# EAGLE design shield (EAGLE 6.6.0)
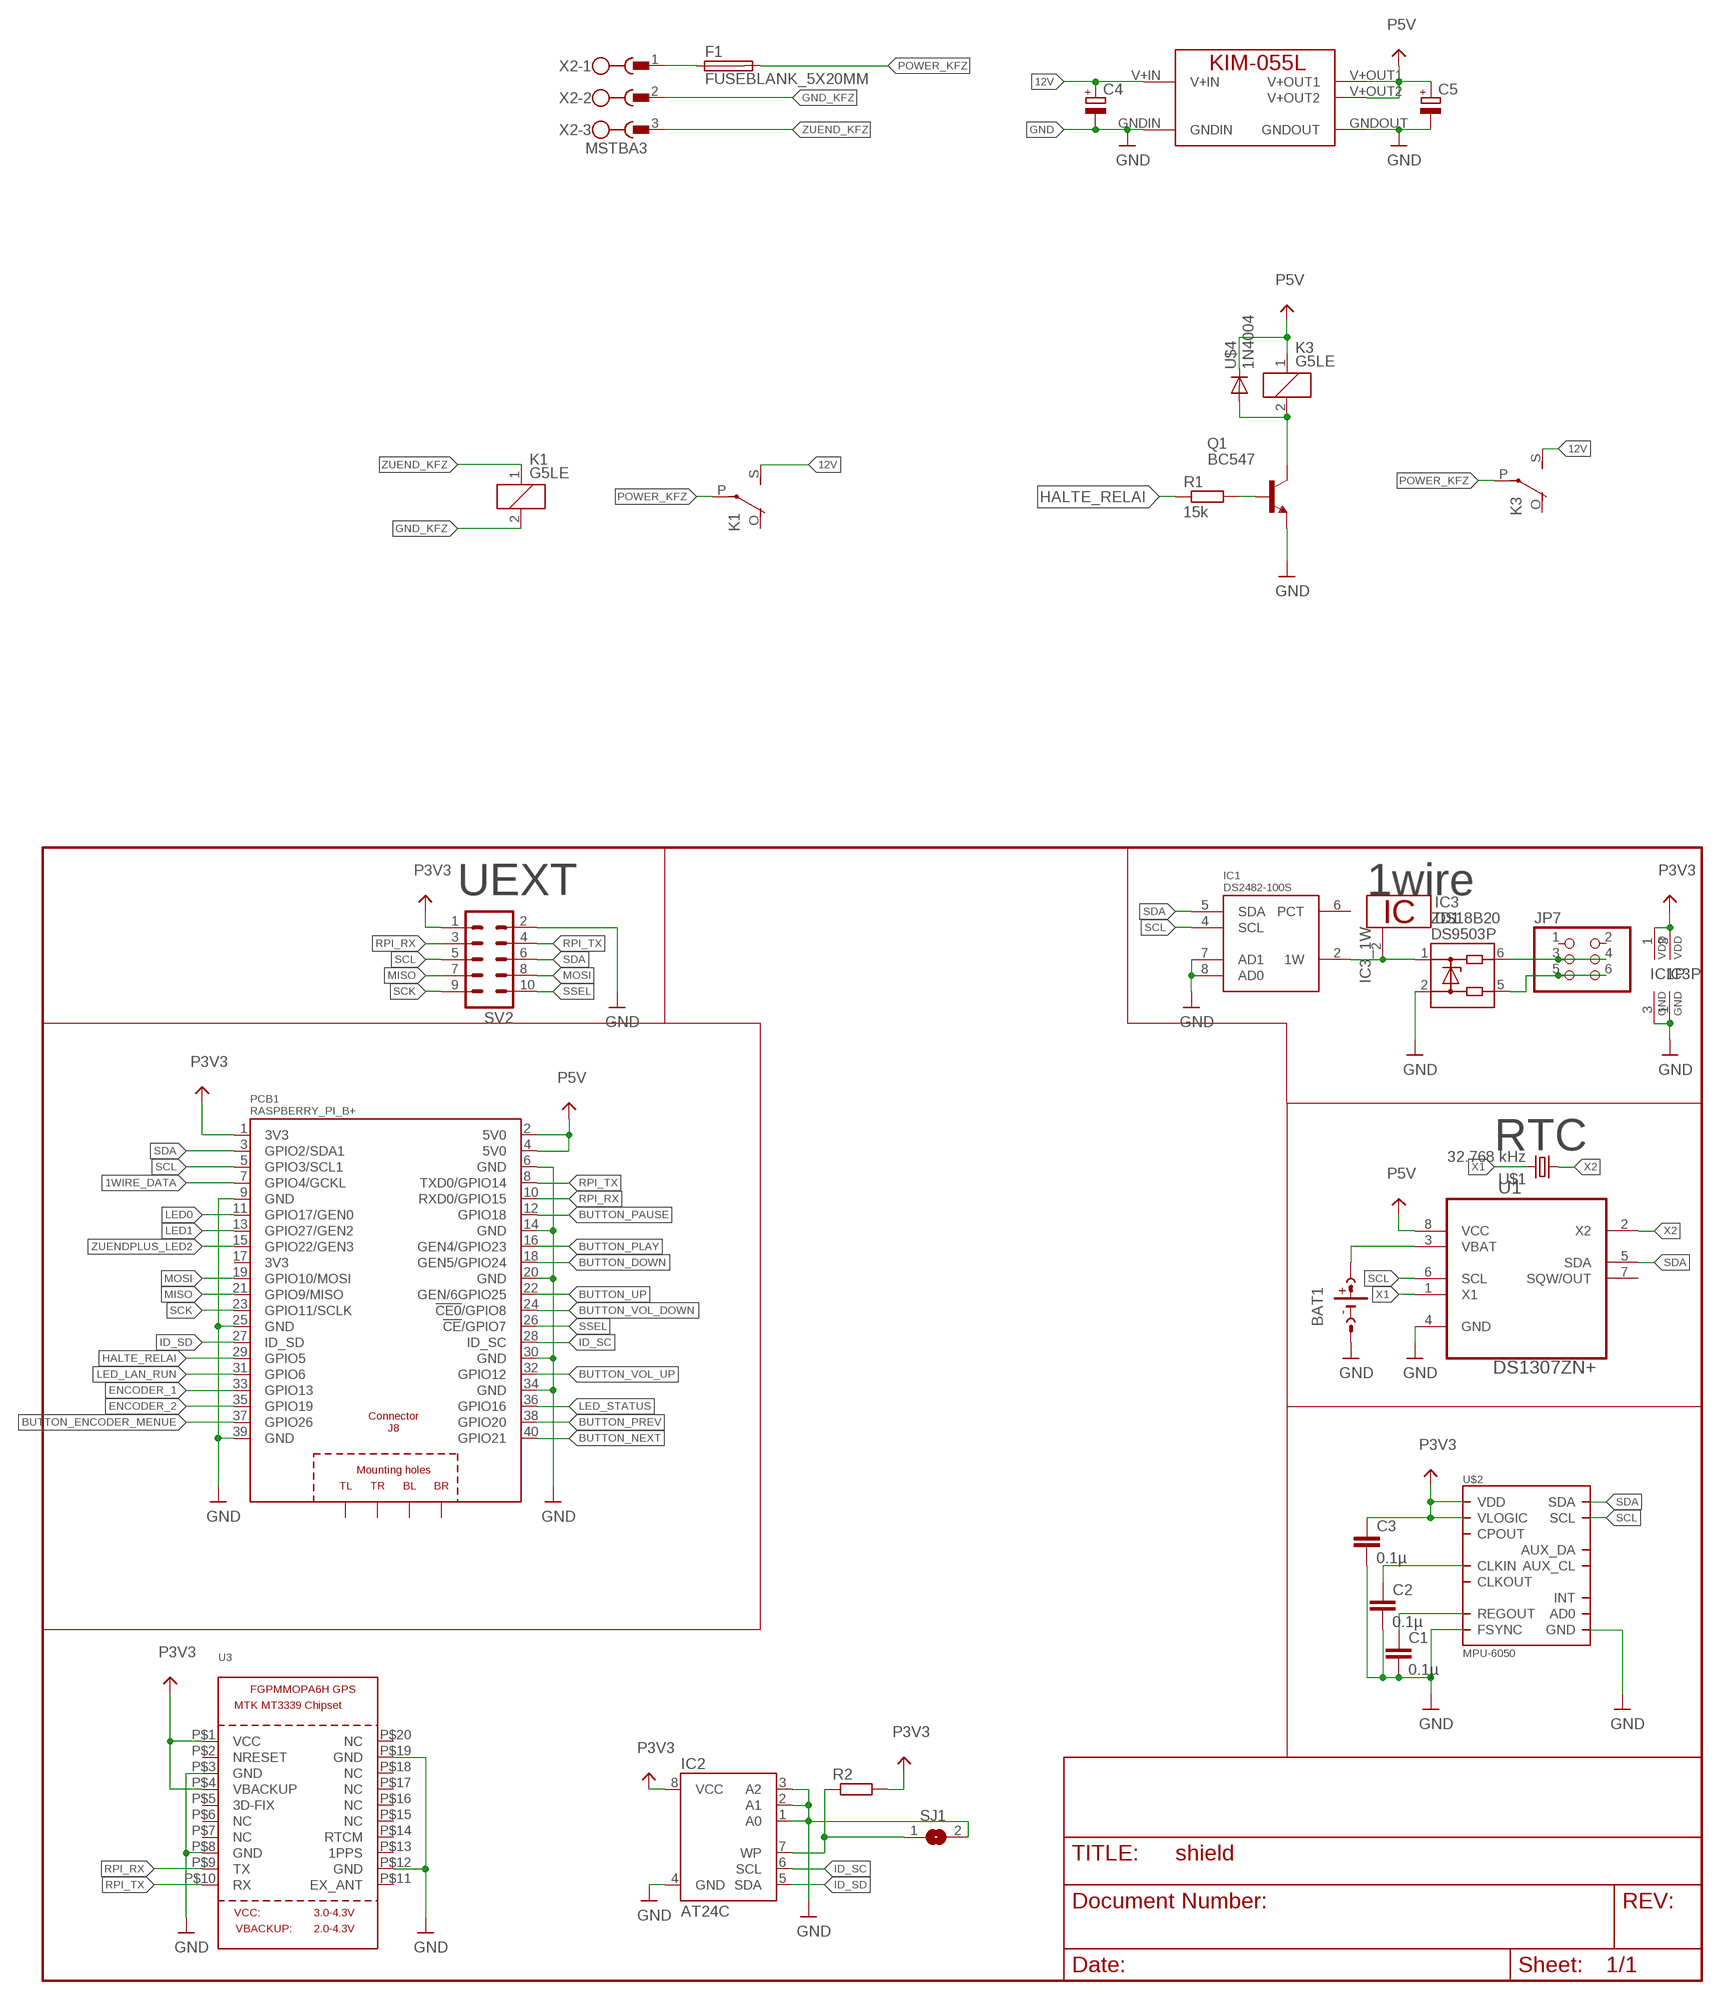
[diagram p0: schematic, sheet 1]

## Parts
BAT1  CR2032  [CR2032-SOCKET]
C1  0.1µ  C-EUC0805  [C0805]
C2  0.1µ  C-EUC0805  [C0805]
C3  0.1µ  C-EUC0805  [C0805]
C4  CPOL-EUE5-13  [E5-13]
C5  CPOL-EUE5-13  [E5-13]
F1  FUSEBLANK_5X20MM  [FUSE_HOLDER_5X20MM]
IC1  DS2482-100S  [SO08]
IC2  AT24C  [SO08]
IC3  DS18B20  [TO92-]
JP7  PINHD-2X3/90  [2X03/90]
K1  G5LE  [G5LE]
K3  G5LE  [G5LE]
MOD1  KIM-055L  [KIM-055L]
PCB1  RASPBERRY_PI_B+  [RASPBERRY_PI_B+]
Q1  BC547  [TO92]
R1  15k  R-EU_0207/7  [0207/7]
R2  R-EU_R0805  [R0805]
SJ1  SJM  [SJM]
SV2  ML10  [ML10]
U1  DS1307ZN+  [SOIC127P600X175-8N]
U3  GPS_FGPMMOPA6H  [FGPMMOPA6H]
U$1  32.768 kHz  CC5V-12,5  [CC5]
U$2  MPU-6050  [QFN.24.4X4]
U$4  1N4004  [DO41-10]
X2  MSTBA3  [MSTBA3]
ZD1  DS9503P  [TSOC6]

## Nets
1WIRE_DATA: IC1.2(1W) IC3.2 PCB1.7(GPIO4/GCKL) ZD1.1
12V: C4.+ K1.S(2:S) K3.S(2:S) MOD1.V+IN
BUTTON_DOWN: PCB1.18(GEN5/GPIO24)
BUTTON_ENCODER_MENUE: PCB1.37(GPIO26)
BUTTON_NEXT: PCB1.40(GPIO21)
BUTTON_PAUSE: PCB1.12(GPIO18)
BUTTON_PLAY: PCB1.16(GEN4/GPIO23)
BUTTON_PREV: PCB1.38(GPIO20)
BUTTON_UP: PCB1.22(GEN/6GPIO25)
BUTTON_VOL_DOWN: PCB1.24(!CE0!/GPIO8)
BUTTON_VOL_UP: PCB1.32(GPIO12)
ENCODER_1: PCB1.33(GPIO13)
ENCODER_2: PCB1.35(GPIO19)
GND: BAT1.M(NEG) C1.2 C2.2 C3.2 C4.- C5.- IC1.3(GND) IC1.7(AD1) IC1.8(AD0) IC2.1(A0) IC2.2(A1) IC2.3(A2) IC2.4(GND) IC3.1 MOD1.GNDIN MOD1.GNDOUT PCB1.6(GND) PCB1.14(GND) PCB1.20(GND) PCB1.30(GND) PCB1.34(GND) Q1.1(E) SJ1.2 SV2.2 U1.4(GND) U3.P$3(GND) U3.P$8(GND) U3.P$12(GND) U3.P$19(GND) U$2.11(FSYNC) U$2.18(GND) ZD1.2
GND@1: PCB1.9(GND) PCB1.25(GND) PCB1.39(GND) ; supply symbol labelled GND
GND_KFZ: K1.2 X2.2
HALTE_RELAI: PCB1.29(GPIO5) R1.1
ID_SC: IC2.6(SCL) PCB1.28(ID_SC)
ID_SD: IC2.5(SDA) PCB1.27(ID_SD)
LED0: PCB1.11(GPIO17/GEN0)
LED1: PCB1.13(GPIO27/GEN2)
LED_LAN_RUN: PCB1.31(GPIO6)
LED_STATUS: PCB1.36(GPIO16)
MISO: PCB1.21(GPIO9/MISO) SV2.7
MOSI: PCB1.19(GPIO10/MOSI) SV2.8
N$1: BAT1.P(POS2) U1.3(VBAT)
N$2: K3.2 Q1.3(C) U$4.A
N$3: C1.1 U$2.10(REGOUT)
N$4: C2.1 U$2.1(CLKIN)
N$5: IC2.7(WP) R2.1 SJ1.1
N$6: Q1.2(B) R1.2
N$7: F1.1 X2.1
N$9: JP7.3 JP7.4 ZD1.6
N$10: JP7.5 JP7.6 ZD1.5
P3V3: C3.1 IC1.1(VDD) IC2.8(VCC) IC3.3 PCB1.1(3V3) R2.2 SV2.1 U3.P$1(VCC) U3.P$4(VBACKUP) U$2.8(VLOGIC) U$2.13(VDD)
P5V: C5.+ K3.1 MOD1.V+OUT1 MOD1.V+OUT2 PCB1.2(5V0) PCB1.4(5V0) U1.8(VCC) U$4.C
POWER_KFZ: F1.2 K1.P(2:P) K3.P(2:P)
RPI_RX: PCB1.10(RXD0/GPIO15) SV2.3 U3.P$9(TX)
RPI_TX: PCB1.8(TXD0/GPIO14) SV2.4 U3.P$10(RX)
SCK: PCB1.23(GPIO11/SCLK) SV2.9
SCL: IC1.4(SCL) PCB1.5(GPIO3/SCL1) SV2.5 U1.6(SCL) U$2.23(SCL)
SDA: IC1.5(SDA) PCB1.3(GPIO2/SDA1) SV2.6 U1.5(SDA) U$2.24(SDA)
SSEL: PCB1.26(!CE!/GPIO7) SV2.10
X1: U1.1(X1) U$1.P$2
X2: U1.2(X2) U$1.P$1
ZUEND_KFZ: K1.1 X2.3
ZUENDPLUS_LED2: PCB1.15(GPIO22/GEN3)
Unconnected: IC1.6(PCT) JP7.1 JP7.2 K1.O(2:O) K3.O(2:O) PCB1.17(3V3) PCB1.PE_BL(BL) PCB1.PE_BR(BR) PCB1.PE_TL(TL) PCB1.PE_TR(TR) U1.7(SQW/OUT) U3.P$2(NRESET) U3.P$5(3D-FIX) U3.P$6(NC) U3.P$7(NC) U3.P$11(EX_ANT) U3.P$13(1PPS) U3.P$14(RTCM) U3.P$15(NC) U3.P$16(NC) U3.P$17(NC) U3.P$18(NC) U3.P$20(NC) U$2.6(AUX_DA) U$2.7(AUX_CL) U$2.9(AD0) U$2.12(INT) U$2.20(CPOUT) U$2.22(CLKOUT)

## Notes on the sheet
- UEXT | 1wire
- RTC

## Library data of the parts
BAT1 = con_bat_2032__s_:CR2032
C1-C3 = schlager_passiv:C-EU: CAPACITOR, European symbol
C4 C5 = schlager_passiv:CPOL-EU: POLARIZED CAPACITOR, European symbol
F1 = fuse:FUSE: Fuse; OC_FARNELL: unknown; OC_NEWARK: unknown
IC1 = 1wire:DS2482-100: I2C to 1-Wire Host Adapter/Line Driver This device is a onewire host and I2C interface in one chip. It provides the complete DC/AC requirements for onewire communication, including overdrive speed mode, but, unlike the DS2480B chip, no 12V EPROM programming. Notes: For overdrive speed and 5V EEPROM programming, an external active pullup circuit must be connected to the 1W, VDD and PCT pin. See the datasheet for details. The lower two I2C adress bits of the chip can be selected by external pins, so up to 4 chips may be connected to the same I2C bus. Author: Orginal device and description from Giovanni Varasano <giovanni.varasano@fastwebnet.it> Improved by Jan Kandziora <jjj@gmx.de>
IC2 = schlager_ics:AT24C*: 2-wire serial EEPROM
IC3 = 1wire:DS18B20: Programmable Resolution Digital Thermometer This chip provides a onewire thermosensor with approx. 0.5°C accuracy. A programmable over/undertemperure alarm is available. The precision can be set from 9..12 bits. Notes: Vdd must be applied for accurate measurements at low temperatures, as the parasite power circuit otherwise heats the sensor. If parasite power is used, Vdd has to be connected to GND. The DS1822 is a low-cost thermometer chip, the DS18S20 is similar to the DS18B20, but with 9 Bit precision only. Author: Jan Kandziora <jjj@gmx.de>
JP7 = pinhead:PINHD-2X3: PIN HEADER
K1 K3 = relay:G5LE: RELAY 1 x switch, 10 A/120 V AC, 8 A/30 V DC, Omron; OC_FARNELL: unknown; OC_NEWARK: unknown
MOD1 = kim055l:KIM-055L: 5V 5amp DC DC module. IMPORANT: Add low ESR input & output capacitors. V+OUT1 & V+OUT2 internally connected.
PCB1 = RASPBERRY_PI_Bplus:RASPBERRY_PI_B+: Raspberry Pi B+ Based on issue: Thursday, July 10, 2014 - Rev 1.2 LBR by Tim R. 07-2014
Q1 = transistor-npn:BC547*: NPN Transistor
R1 R2 = schlager_passiv:R-EU_: RESISTOR, European symbol
SJ1 = jumper:SJ: SMD solder JUMPER
SV2 = X_Pfostenstecker:ML10: HARTING; OC_FARNELL: unknown; OC_NEWARK: unknown
U1 = schlager_ics:DS1307ZN+: 64 x 8, Serial, I2C Real-Time Clock; MPN: DS1307ZN+; OC_FARNELL: 9725253; OC_NEWARK: 96K8872; PACKAGE: SOIC-8; SUPPLIER: Maxim
U3 = adafruit:GPS_FGPMMOPA6H: GPS Module - MTK MT3339 Chipset, -165dBm sensitivity, 22 channels, 10Hz, auto-select external antenna options
U$1 = schlager_Quarze:CC5V; MPN: CC5V-T1A 32,768KHZ 12,5PF; OC_FARNELL: 1539374RL; OC_REICHELT: 32,768 CC5V-12,5
U$2 = invensense:MPU-6050
U$4 = diode:1N4004: DIODE general purpose rectifier, 1 A
X2 = X_Phoenix:MSTBA3: PHOENIX
ZD1 = 1wire:DS9503: ESD Protection Diode with Resistors This ESD protection diode is designed especially for onewire host interfaces. Unlike the DS9502, it has two additional 5Ohm resitors in the 1W and GND line. Pin 5 and 6 have to be connected to the host side, pin 1 und 2 to the network side. The 1W line is through pin 1 and 6, the GND line is through pin 2 and 5. Author: Jan Kandziora <jjj@gmx.de>

## Board
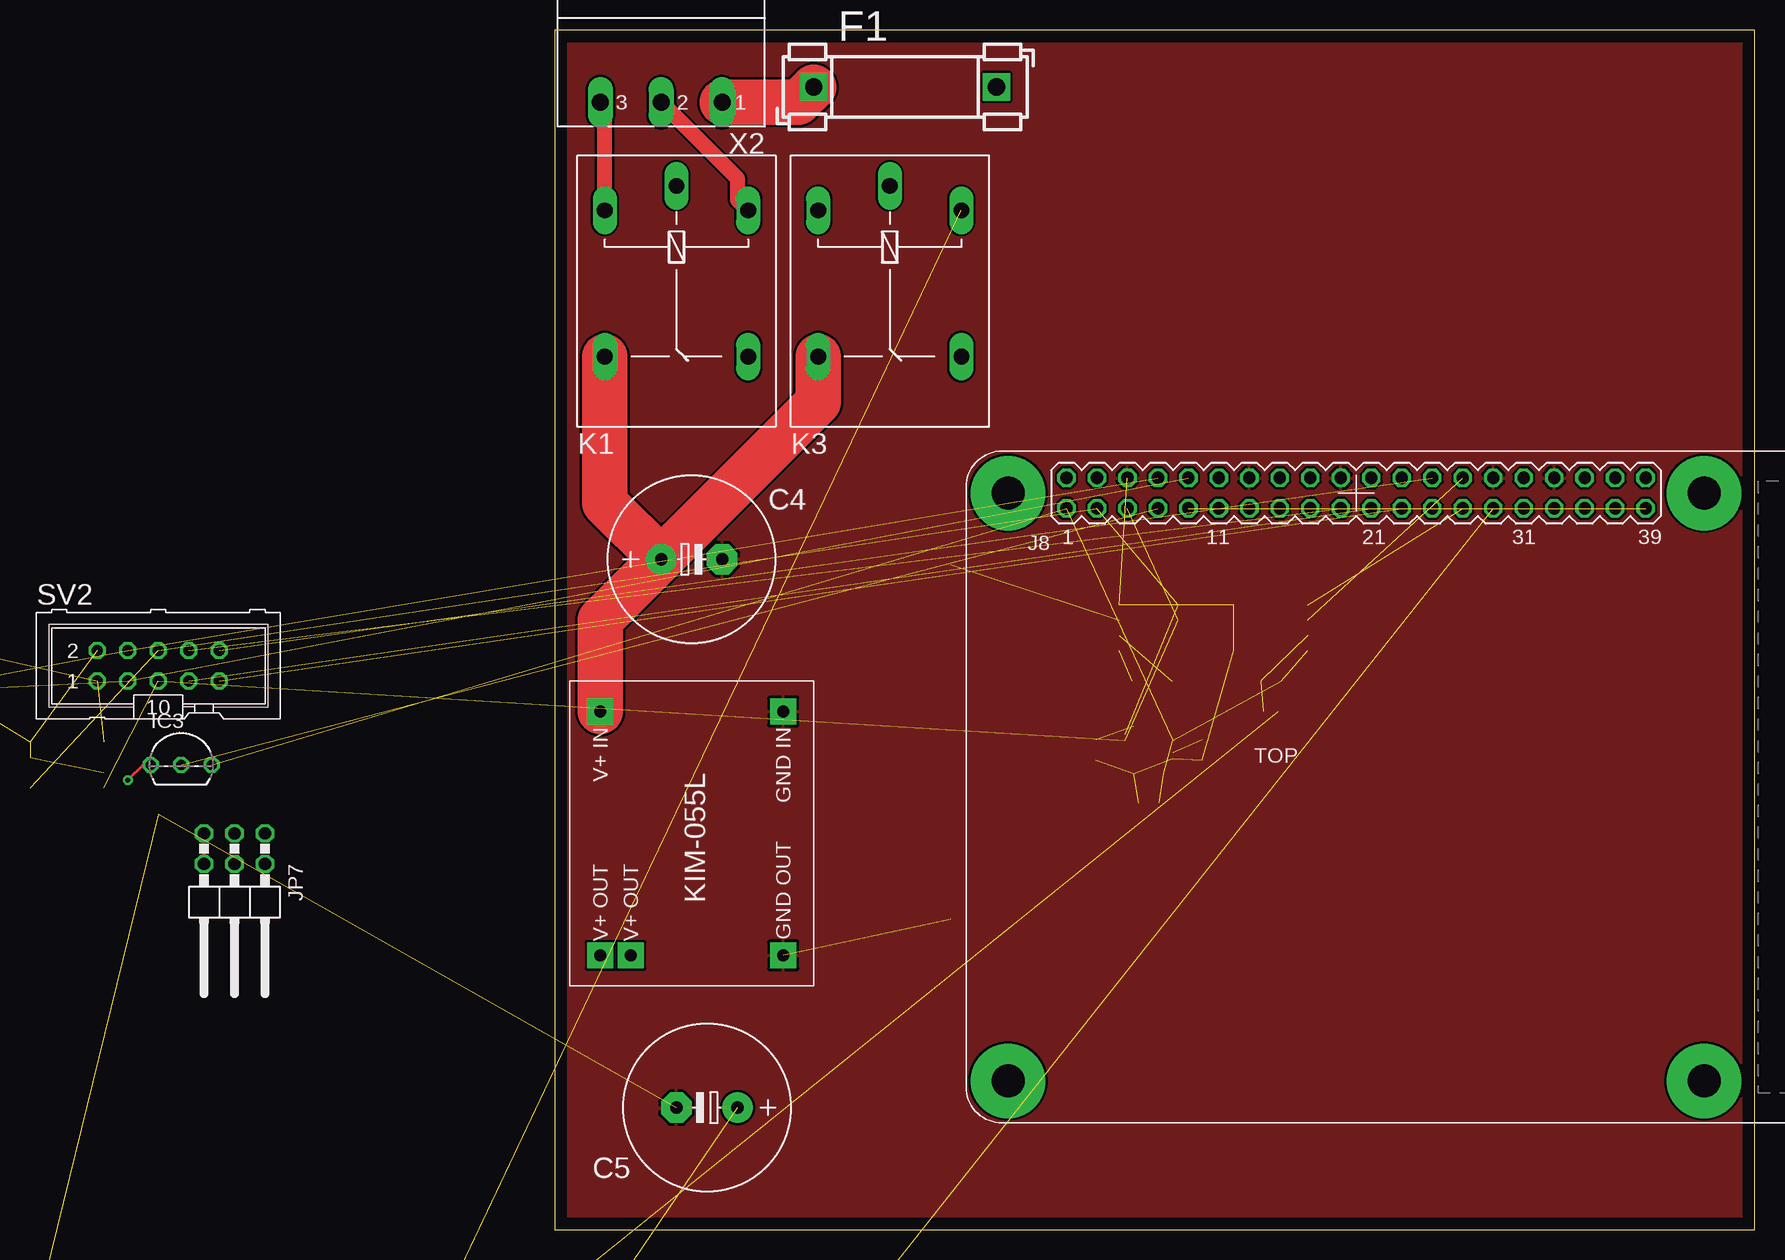
[diagram p1: board, top side]
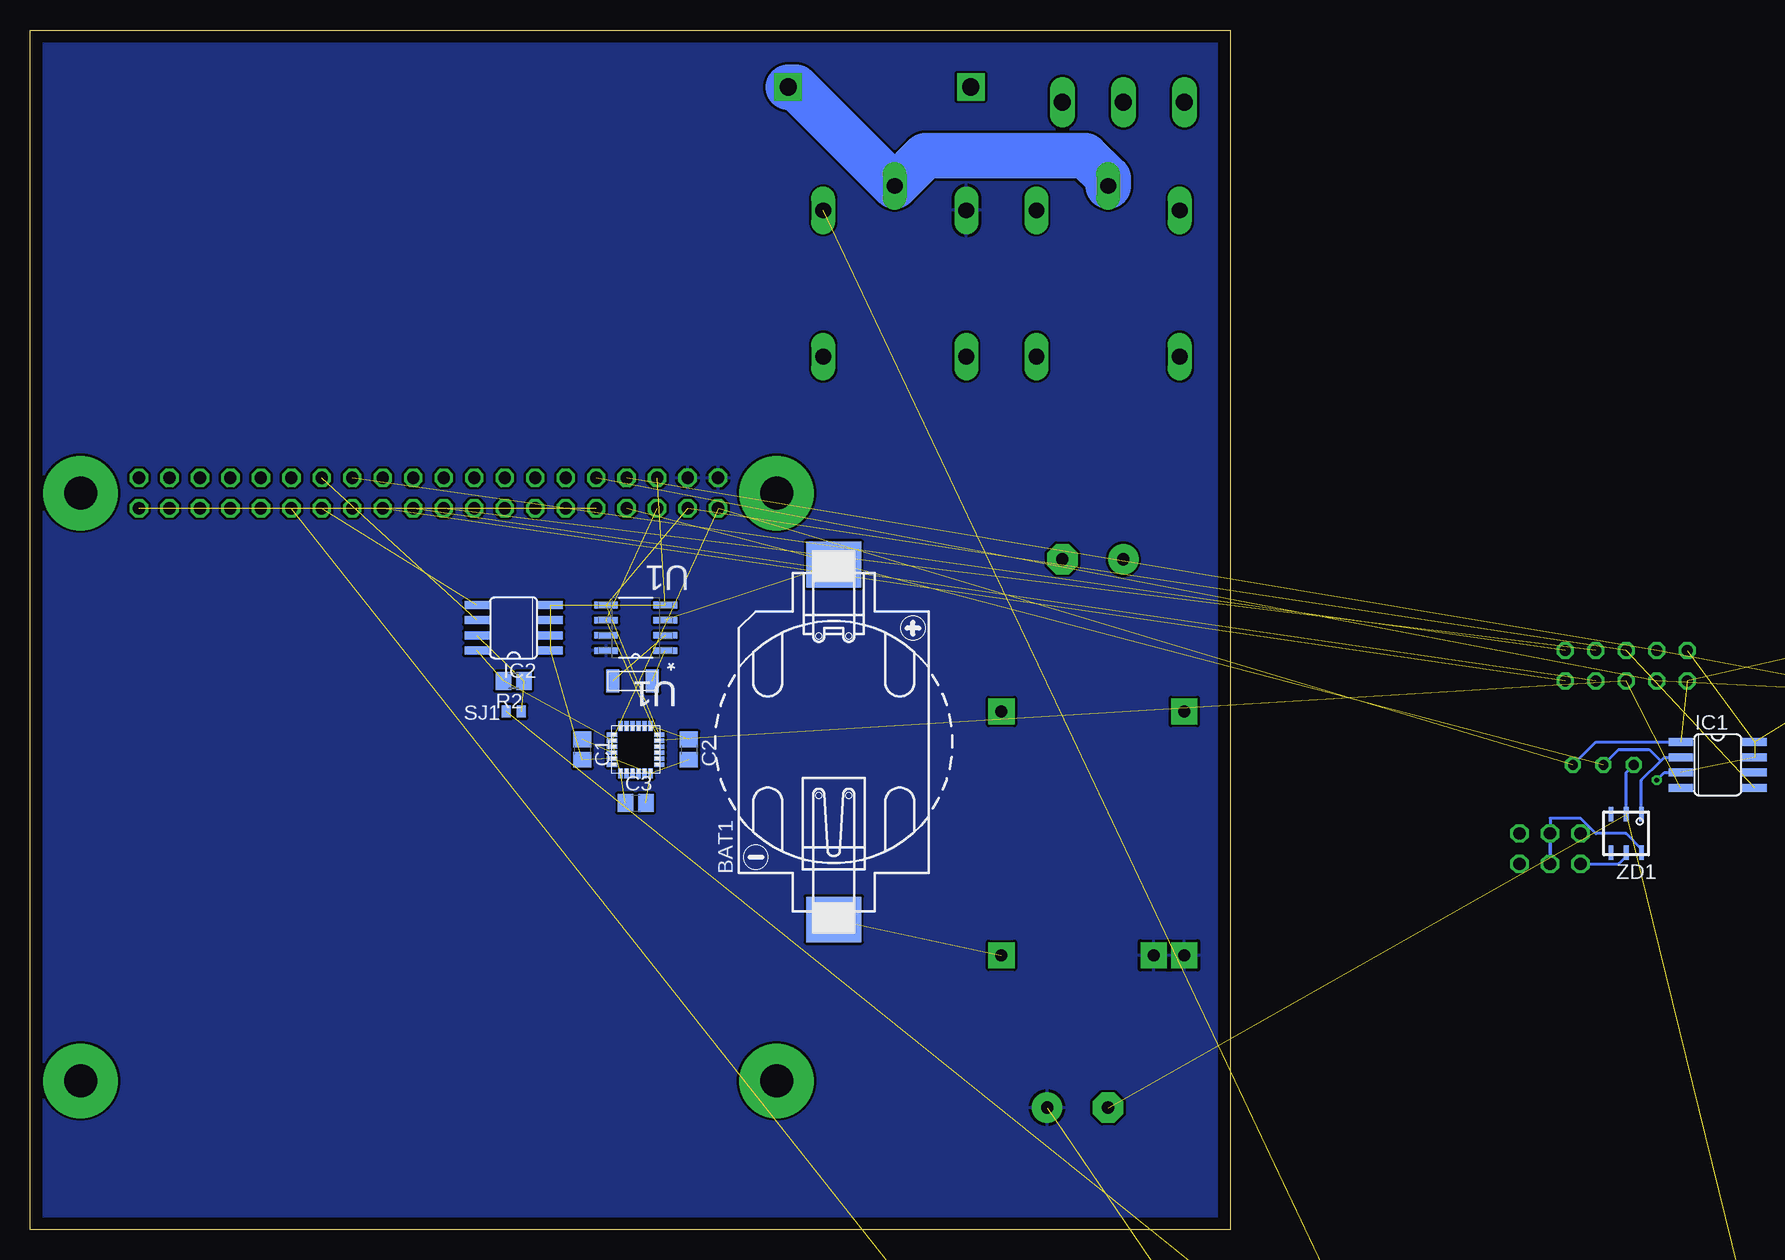
[diagram p2: board, bottom side, seen from below]

Size 100 x 100 mm. Coordinates in mm from the lower left corner, seen from the top.
Outline: 0,0 100,0 100,100 0,100 0,0
Copper layers (1*16): Top 0.035mm / dielectric 1.5mm / Bottom 0.035mm
Design rules "default": minimum track width 10mil, minimum drill 24mil, track to track 8mil, track to pad 8mil, pad to pad 8mil, via to via 8mil, smd to smd 8mil, copper to edge 40mil, drill to drill 8mil, minimum pad ring 10mil, minimum via ring 8mil, stop-mask expansion 4mil, vias tented up to drill 0mil, thermal gap 10mil

### Footprints (pad centres in the part's own frame; a part is rotated, then mirrored left to right if it is on the bottom)
CR2032-SOCKET = smd 3.8 x 4.6: M -14.8,0; P 14.8,0
C0805 = smd 1.3 x 1.5: 1 -0.85,0; 2 0.85,0
E5-13 = drill 1.016 pad 2.54: + -2.54,0 | drill 1.016 pad 2.54 octagon: - 2.54,0
FUSE_HOLDER_5X20MM = drill 1.422 pad 2.286 square: 1 0,0; 2 15.24,0
SO08 = smd 0.66 x 2.032: 1 -1.905,-3.073; 2 -0.635,-3.073; 3 0.635,-3.073; 4 1.905,-3.073; 5 1.905,3.073; 6 0.635,3.073; 7 -0.635,3.073; 8 -1.905,3.073
TO92- = drill 0.813 octagon: 1 -2.54,0; 2 0,0; 3 2.54,0
2X03/90 = drill 1.016 octagon: 1 -2.54,-6.35; 2 -2.54,-3.81; 3 0,-6.35; 4 0,-3.81; 5 2.54,-6.35; 6 2.54,-3.81
G5LE = drill 1.321 long: 1 -7.493,-5.969; 2 -7.493,5.969; O 4.699,5.969; P -9.525,0; S 4.699,-5.969
KIM-055L = drill 1 pad 2.184 square: GNDIN -10.16,7.62; GNDOUT 10.16,7.62; V+IN -10.16,-7.62; V+OUT1 10.16,-5.08; V+OUT2 10.16,-7.62
RASPBERRY_PI_B+ = drill 1.016 octagon: 1 8.37,51.23; 2 8.37,53.77; 3 10.91,51.23; 4 10.91,53.77; 5 13.45,51.23; 6 13.45,53.77; 7 15.99,51.23; 8 15.99,53.77; 9 18.53,51.23; 10 18.53,53.77; 11 21.07,51.23; 12 21.07,53.77; 13 23.61,51.23; 14 23.61,53.77; 15 26.15,51.23; 16 26.15,53.77; 17 28.69,51.23; 18 28.69,53.77; 19 31.23,51.23; 20 31.23,53.77; 21 33.77,51.23; 22 33.77,53.77; 23 36.31,51.23; 24 36.31,53.77; 25 38.85,51.23; 26 38.85,53.77; 27 41.39,51.23; 28 41.39,53.77; 29 43.93,51.23; 30 43.93,53.77; 31 46.47,51.23; 32 46.47,53.77; 33 49.01,51.23; 34 49.01,53.77; 35 51.55,51.23; 36 51.55,53.77; 37 54.09,51.23; 38 54.09,53.77; 39 56.63,51.23; 40 56.63,53.77 | drill 2.75 pad 6.2: PE_BL 3.5,3.5; PE_BR 61.5,3.5; PE_TL 3.5,52.5; PE_TR 61.5,52.5
TO92 = drill 0.813 octagon: 1 1.27,0; 2 0,1.905; 3 -1.27,0
0207/7 = drill 0.813 octagon: 1 -3.81,0; 2 3.81,0
R0805 = smd 1.3 x 1.5: 1 -0.85,0; 2 0.85,0
SJM = smd 0.762 x 1.016: 1 -0.635,0; 2 0.622,0
ML10 = drill 0.914 octagon: 1 -5.08,-1.27; 2 -5.08,1.27; 3 -2.54,-1.27; 4 -2.54,1.27; 5 0,-1.27; 6 0,1.27; 7 2.54,-1.27; 8 2.54,1.27; 9 5.08,-1.27; 10 5.08,1.27
SOIC127P600X175-8N = smd 1.981 x 0.559: 1 -2.464,1.905; 2 -2.464,0.635; 3 -2.464,-0.635; 4 -2.464,-1.905; 5 2.464,-1.905; 6 2.464,-0.635; 7 2.464,0.635; 8 2.464,1.905
FGPMMOPA6H = smd 2 x 1: P$1 -7.5,6.75; P$2 -7.5,5.25; P$3 -7.5,3.75; P$4 -7.5,2.25; P$5 -7.5,0.75; P$6 -7.5,-0.75; P$7 -7.5,-2.25; P$8 -7.5,-3.75; P$9 -7.5,-5.25; P$10 -7.5,-6.75; P$11 7.5,-6.75; P$12 7.5,-5.25; P$13 7.5,-3.75; P$14 7.5,-2.25; P$15 7.5,-0.75; P$16 7.5,0.75; P$17 7.5,2.25; P$18 7.5,3.75; P$19 7.5,5.25; P$20 7.5,6.75 | hole 3: 0.5,0.85
CC5 = smd 1.1 x 1.9: P$1 0,0; P$2 3.3,0
QFN.24.4X4 = smd 0.85 x 0.38: 1 -1.975,1.25; 2 -1.975,0.75; 3 -1.975,0.25; 4 -1.975,-0.25; 5 -1.975,-0.75; 6 -1.975,-1.25; 13 1.975,-1.25; 14 1.975,-0.75; 15 1.975,-0.25; 16 1.975,0.25; 17 1.975,0.75; 18 1.975,1.25 | smd 0.38 x 0.85: 7 -1.25,-1.975; 8 -0.75,-1.975; 9 -0.25,-1.975; 10 0.25,-1.975; 11 0.75,-1.975; 12 1.25,-1.975; 19 1.25,1.975; 20 0.75,1.975; 21 0.25,1.975; 22 -0.25,1.975; 23 -0.75,1.975; 24 -1.25,1.975
DO41-10 = drill 1.118: A 5.08,0; C -5.08,0
MSTBA3 = drill 1.397 long: 1 -5.08,5.08; 2 0,5.08; 3 5.08,5.08
TSOC6 = smd 0.406 x 1.219: 1 -1.27,-1.6; 2 0,-1.6; 3 1.27,-1.6; 4 1.27,1.6; 5 0,1.6; 6 -1.27,1.6

### Placement (x,y rotation side)
BAT1  33.02,40.64 90 bottom
C1  53.98,40.01 270 bottom
C2  45.09,40.01 270 bottom
C3  49.53,35.56 0 bottom
C4  11.43,55.88 0 top
C5  12.7,10.16 180 top
F1  21.59,95.25 0 top
IC1  -40.64,38.73 270 bottom  (outside the outline)
IC2  59.69,50.16 90 bottom
IC3  -31.11,38.73 0 top  (outside the outline)
JP7  -26.67,26.67 180 top  (outside the outline)
K1  10.16,77.47 270 top
K3  27.94,77.47 270 top
MOD1  11.43,33.02 270 top
PCB1  34.29,8.89 0 top
Q1  -54.61,-48.26 0 top  (outside the outline)
R1  -17.78,-66.04 0 top  (outside the outline)
R2  59.69,45.72 180 bottom
SJ1  59.69,43.18 180 bottom
SV2  -33.02,46.99 0 top  (outside the outline)
U1  49.53,50.16 180 bottom
U3  -57.15,49.53 0 top  (outside the outline)
U$1  51.44,45.72 0 bottom
U$2  49.53,40.01 270 bottom
U$4  -11.43,-21.59 180 top  (outside the outline)
X2  8.89,99.06 180 top
ZD1  -33.02,33.02 180 bottom  (outside the outline)

### Tracks (layer width: path | path; a pad name or v marks a point on that pad's centre or on a via)
1WIRE_DATA  (1 unrouted)
  Bottom 0.254: ZD1.1 -34.29,37.47 -35.88,39.05 | -35.88,39.05 -36.2,39.37 IC1.2 | IC3.2 -32.38,40.01 -34.92,40.01 -35.88,39.05
12V
  Top 3.81: K1.S 4.19,60.58 C4.+ | K3.S 21.97,68.96 C4.+ | MOD1.V+IN 3.81,50.8 C4.+
GND  (via drill 0.4)  (21 unrouted)
  Top 0.254: IC3.1 -34.29,38.73 v-35.56,37.47
  Bottom 0.254: ZD1.2 -33.02,38.1 IC3.1 | v-35.56,37.47 -36.2,38.1 IC1.3
  pour Top: -3.81,109.22 107.95,109.22 107.95,-6.35 -3.81,-6.35
GND@1  (2 unrouted)
GND_KFZ
  Top 1.27: X2.2 15.24,87.63 15.24,85.85 K1.2
HALTE_RELAI  (1 unrouted)
ID_SC  (1 unrouted)
ID_SD  (1 unrouted)
MISO  (1 unrouted)
MOSI  (1 unrouted)
N$1  (1 unrouted)
N$2  (2 unrouted)
N$3  (1 unrouted)
N$4  (1 unrouted)
N$5  (2 unrouted)
N$6  (1 unrouted)
N$7
  Top 3.81: X2.1 20.32,93.98 F1.1
N$9
  Bottom 0.254: ZD1.6 -34.29,31.75 -33.02,33.02 -30.48,33.02 -29.21,34.29 -26.67,34.29 JP7.4 JP7.3
N$10
  Top 0.254: JP7.6 JP7.5
  Bottom 0.254: JP7.6 -32.38,30.48 -33.02,31.11 ZD1.5
P3V3  (9 unrouted)
  Bottom 0.254: IC3.3 -30.48,40.64 IC1.1
P5V  (1 unrouted)
  pour Bottom: -3.81,109.22 110.49,109.22 110.49,-6.35 -3.81,-6.35
POWER_KFZ
  Bottom 3.81: K1.P 10.16,87.63 12.06,89.53 25.4,89.53 K3.P 36.2,95.25 F1.2
RPI_RX  (2 unrouted)
RPI_TX  (2 unrouted)
SCK  (1 unrouted)
SCL  (4 unrouted)
SDA  (4 unrouted)
SSEL  (1 unrouted)
X1  (1 unrouted)
X2  (1 unrouted)
ZUEND_KFZ
  Top 1.27: K1.1 4.19,93.6 X2.3